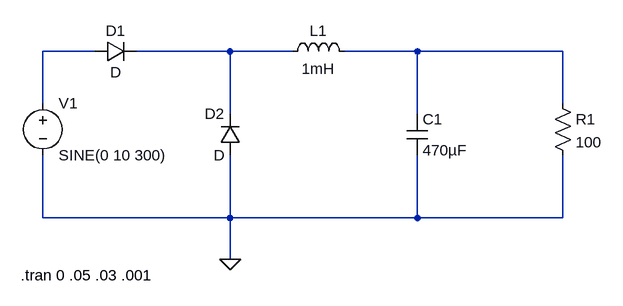
[diagram p0: schematic Draft1.asc]
Draft1.asc, the LTspice schematic file:
Version 4
SHEET 1 980 680
WIRE 192 80 112 80
WIRE 400 80 256 80
WIRE 496 80 400 80
WIRE 688 80 576 80
WIRE 912 80 688 80
WIRE 112 160 112 80
WIRE 912 160 912 80
WIRE 400 176 400 80
WIRE 688 176 688 80
WIRE 112 336 112 240
WIRE 400 336 400 240
WIRE 400 336 112 336
WIRE 688 336 688 240
WIRE 688 336 400 336
WIRE 912 336 912 240
WIRE 912 336 688 336
WIRE 400 400 400 336
FLAG 400 400 0
SYMBOL voltage 112 144 R0
WINDOW 123 0 0 Left 0
WINDOW 39 0 0 Left 0
SYMATTR InstName V1
SYMATTR Value SINE(0 10 300)
SYMBOL diode 192 96 R270
WINDOW 0 32 32 VTop 2
WINDOW 3 0 32 VBottom 2
SYMATTR InstName D1
SYMBOL diode 416 240 R180
WINDOW 0 24 64 Left 2
WINDOW 3 24 0 Left 2
SYMATTR InstName D2
SYMBOL ind 480 96 R270
WINDOW 0 32 56 VTop 2
WINDOW 3 5 56 VBottom 2
SYMATTR InstName L1
SYMATTR Value 1mH
SYMBOL cap 672 176 R0
SYMATTR InstName C1
SYMATTR Value 470µF
SYMBOL res 896 144 R0
SYMATTR InstName R1
SYMATTR Value 100
TEXT 78 424 Left 2 !.tran 0 .05 .03 .001

The netlist it stands for:
* Draft1.asc
V1 N001 0 SINE(0 10 300)
D1 N001 N002 D
D2 0 N002 D
L1 N002 N003 1mH
C1 N003 0 470µF
R1 N003 0 100
.model D D
.lib standard.dio
.tran 0 .05 .03 .001
.backanno
.end